# Altium project SnippetsMCU.PrjPCB
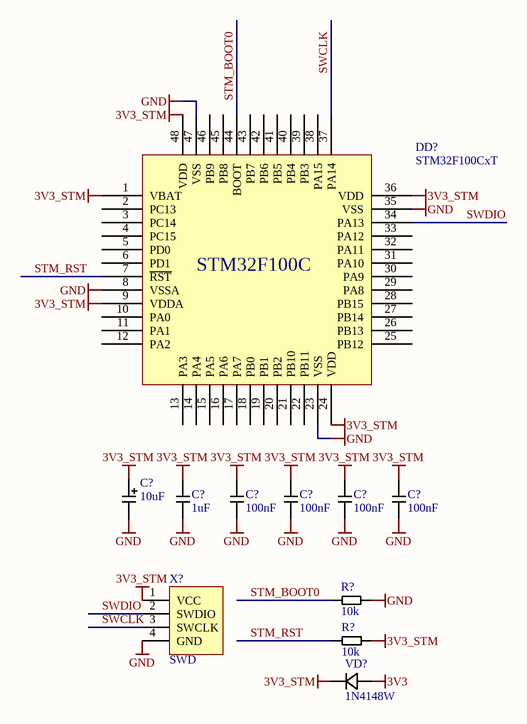
[diagram p0: STM32F100CxT_simple.SchDoc]
9 sheets, 140 parts. Net scope: global (net labels, ports and power ports of the same name join across sheets).
Sheets:
  STM32F100CxT_simple.SchDoc
  STM32F100CxT_with_analog.SchDoc
  STM32F100RxT_simple.SchDoc
  STM32F103CxT_simple.SchDoc
  STM32F103RxT_simple.SchDoc
  STM32F407VxT_simple.SchDoc
  STM32F417VxT_simple.SchDoc
  TM4C1294NCPDT_simple.SchDoc
  STM32F302VBT_simple.SchDoc

## Sheet STM32F100CxT_simple.SchDoc
size A4

### Parts
(Parts that share a designator on the sheet are numbered #1, #2 ... from top to bottom, then left to right.)
C?#1  10uF  [SMD A]
C?#2  1uF  [C0603]
C?#3  100nF  [C0603]
C?#4  100nF  [C0603]
C?#5  100nF  [C0603]
C?#6  100nF  [C0603]
DD?#1  STM32F100CxT  [LQFP-48]
R?#1  10k  [R0603]
R?#2  10k  [R0603]
VD?#1  1N4148W  [SOD-123]
X?#1  SWD  [SWD-4]

### Nets
3V3: VD?#1.1(K)
3V3_STM: C?#1.1 C?#2.1 C?#3.1 C?#4.1 C?#5.1 C?#6.1 DD?#1.1(VBAT) DD?#1.9(VDDA) DD?#1.24(VDD) DD?#1.36(VDD) DD?#1.48(VDD) R?#2.2 VD?#1.2(A) X?#1.1(VCC)
GND: C?#1.2 C?#2.2 C?#3.2 C?#4.2 C?#5.2 C?#6.2 DD?#1.8(VSSA) DD?#1.23(VSS) DD?#1.35(VSS) DD?#1.47(VSS) R?#1.1 X?#1.4(GND)
STM_BOOT0: DD?#1.44(BOOT) R?#1.2
STM_RST: DD?#1.7(~{RST}) R?#2.1
SWCLK: DD?#1.37(PA14) X?#1.3(SWCLK)
SWDIO: DD?#1.34(PA13) X?#1.2(SWDIO)

Not connected (* = marked no-connect by the designer): DD?#1 2(PC13) 3(PC14) 4(PC15) 5(PD0) 6(PD1) 10(PA0) 11(PA1) 12(PA2) 13(PA3) 14(PA4) 15(PA5) 16(PA6) 17(PA7) 18(PB0) 19(PB1) 20(PB2) 21(PB10) 22(PB11) 25(PB12) 26(PB13) 27(PB14) 28(PB15) 29(PA8) 30(PA9) 31(PA10) 32(PA11) 33(PA12) 38(PA15) 39(PB3) 40(PB4) 41(PB5) 42(PB6) 43(PB7) 45(PB8) 46(PB9)

### Notes on the sheet
- (in symbol STM32F100CxT) STM32F100C

### Library data of the parts
C?#1 = CP: Capacitor polarized
C?#2-C?#6 = C: Capacitor
DD?#1 = STM32F100CxT: STM Microcontroller
R?#1 R?#2 = R: Resistor
VD?#1 = Diode: SMD diode
X?#1 = SWD_4: SWD connector

## Sheet STM32F100CxT_with_analog.SchDoc
size A4
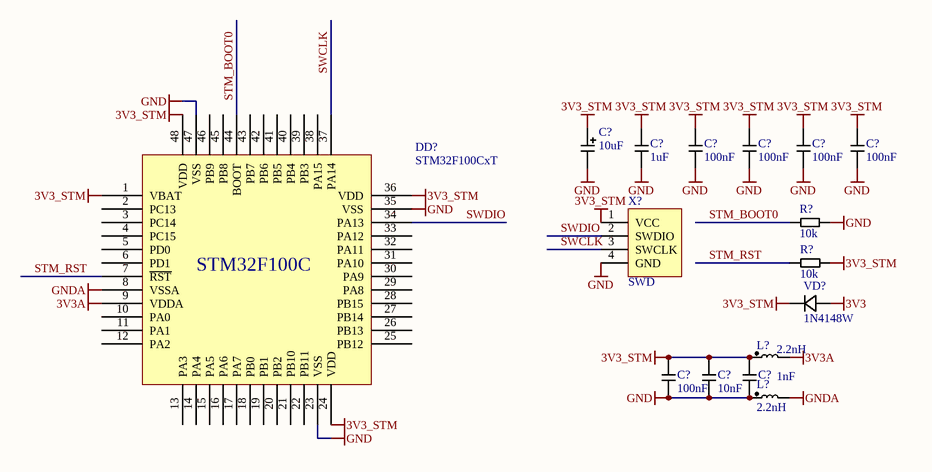
[diagram p1: STM32F100CxT_with_analog.SchDoc]

### Parts
(Parts that share a designator on the sheet are numbered #1, #2 ... from top to bottom, then left to right.)
C?#7  10uF  [SMD A]
C?#8  1uF  [C0603]
C?#9  100nF  [C0603]
C?#10  100nF  [C0603]
C?#11  100nF  [C0603]
C?#12  100nF  [C0603]
C?#13  100nF  [C0603]
C?#14  10nF  [C0603]
C?#15  1nF  [C0603]
DD?#2  STM32F100CxT  [LQFP-48]
L?#1  2.2nH  [L0603]
L?#2  2.2nH  [L0603]
R?#3  10k  [R0603]
R?#4  10k  [R0603]
VD?#2  1N4148W  [SOD-123]
X?#2  SWD  [SWD-4]

### Nets
3V3: VD?#2.1(K)
3V3_STM: C?#7.1 C?#8.1 C?#9.1 C?#10.1 C?#11.1 C?#12.1 C?#13.1 C?#14.1 C?#15.1 DD?#2.1(VBAT) DD?#2.24(VDD) DD?#2.36(VDD) DD?#2.48(VDD) L?#1.1 R?#4.2 VD?#2.2(A) X?#2.1(VCC)
3V3A: DD?#2.9(VDDA) L?#1.2
GND: C?#7.2 C?#8.2 C?#9.2 C?#10.2 C?#11.2 C?#12.2 C?#13.2 C?#14.2 C?#15.2 DD?#2.23(VSS) DD?#2.35(VSS) DD?#2.47(VSS) L?#2.1 R?#3.1 X?#2.4(GND)
GNDA: DD?#2.8(VSSA) L?#2.2
STM_BOOT0: DD?#2.44(BOOT) R?#3.2
STM_RST: DD?#2.7(~{RST}) R?#4.1
SWCLK: DD?#2.37(PA14) X?#2.3(SWCLK)
SWDIO: DD?#2.34(PA13) X?#2.2(SWDIO)

Not connected (* = marked no-connect by the designer): DD?#2 2(PC13) 3(PC14) 4(PC15) 5(PD0) 6(PD1) 10(PA0) 11(PA1) 12(PA2) 13(PA3) 14(PA4) 15(PA5) 16(PA6) 17(PA7) 18(PB0) 19(PB1) 20(PB2) 21(PB10) 22(PB11) 25(PB12) 26(PB13) 27(PB14) 28(PB15) 29(PA8) 30(PA9) 31(PA10) 32(PA11) 33(PA12) 38(PA15) 39(PB3) 40(PB4) 41(PB5) 42(PB6) 43(PB7) 45(PB8) 46(PB9)

### Notes on the sheet
- (in symbol STM32F100CxT) STM32F100C

### Library data of the parts
C?#7 = CP: Capacitor polarized
C?#8-C?#15 = C: Capacitor
DD?#2 = STM32F100CxT: STM Microcontroller
L?#1 L?#2 = L: Inductor
R?#3 R?#4 = R: Resistor
VD?#2 = Diode: SMD diode
X?#2 = SWD_4: SWD connector

## Sheet STM32F100RxT_simple.SchDoc
size A4
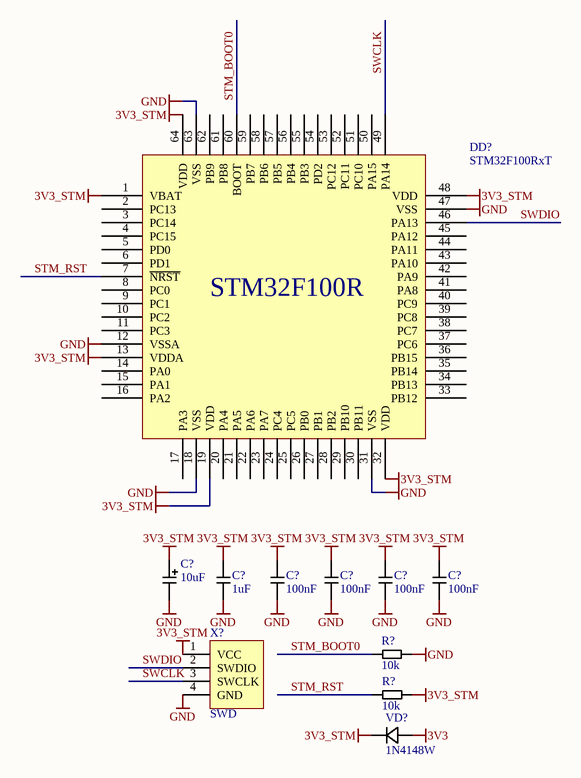
[diagram p2: STM32F100RxT_simple.SchDoc]

### Parts
(Parts that share a designator on the sheet are numbered #1, #2 ... from top to bottom, then left to right.)
C?#16  10uF  [SMD A]
C?#17  1uF  [C0603]
C?#18  100nF  [C0603]
C?#19  100nF  [C0603]
C?#20  100nF  [C0603]
C?#21  100nF  [C0603]
DD?#3  STM32F100RxT  [LQFP-64]
R?#5  10k  [R0603]
R?#6  10k  [R0603]
VD?#3  1N4148W  [SOD-123]
X?#3  SWD  [SWD-4]

### Nets
3V3: VD?#3.1(K)
3V3_STM: C?#16.1 C?#17.1 C?#18.1 C?#19.1 C?#20.1 C?#21.1 DD?#3.1(VBAT) DD?#3.13(VDDA) DD?#3.19(VDD) DD?#3.32(VDD) DD?#3.48(VDD) DD?#3.64(VDD) R?#6.2 VD?#3.2(A) X?#3.1(VCC)
GND: C?#16.2 C?#17.2 C?#18.2 C?#19.2 C?#20.2 C?#21.2 DD?#3.12(VSSA) DD?#3.18(VSS) DD?#3.31(VSS) DD?#3.47(VSS) DD?#3.63(VSS) R?#5.1 X?#3.4(GND)
STM_BOOT0: DD?#3.60(BOOT) R?#5.2
STM_RST: DD?#3.7(~{NRST}) R?#6.1
SWCLK: DD?#3.49(PA14) X?#3.3(SWCLK)
SWDIO: DD?#3.46(PA13) X?#3.2(SWDIO)

Not connected (* = marked no-connect by the designer): DD?#3 2(PC13) 3(PC14) 4(PC15) 5(PD0) 6(PD1) 8(PC0) 9(PC1) 10(PC2) 11(PC3) 14(PA0) 15(PA1) 16(PA2) 17(PA3) 20(PA4) 21(PA5) 22(PA6) 23(PA7) 24(PC4) 25(PC5) 26(PB0) 27(PB1) 28(PB2) 29(PB10) 30(PB11) 33(PB12) 34(PB13) 35(PB14) 36(PB15) 37(PC6) 38(PC7) 39(PC8) 40(PC9) 41(PA8) 42(PA9) 43(PA10) 44(PA11) 45(PA12) 50(PA15) 51(PC10) 52(PC11) 53(PC12) 54(PD2) 55(PB3) 56(PB4) 57(PB5) 58(PB6) 59(PB7) 61(PB8) 62(PB9)

### Notes on the sheet
- (in symbol STM32F100RxT) STM32F100R

### Library data of the parts
C?#16 = CP: Capacitor polarized
C?#17-C?#21 = C: Capacitor
DD?#3 = STM32F100RxT: STM Microcontroller
R?#5 R?#6 = R: Resistor
VD?#3 = Diode: SMD diode
X?#3 = SWD_4: SWD connector

## Sheet STM32F103CxT_simple.SchDoc
size A4
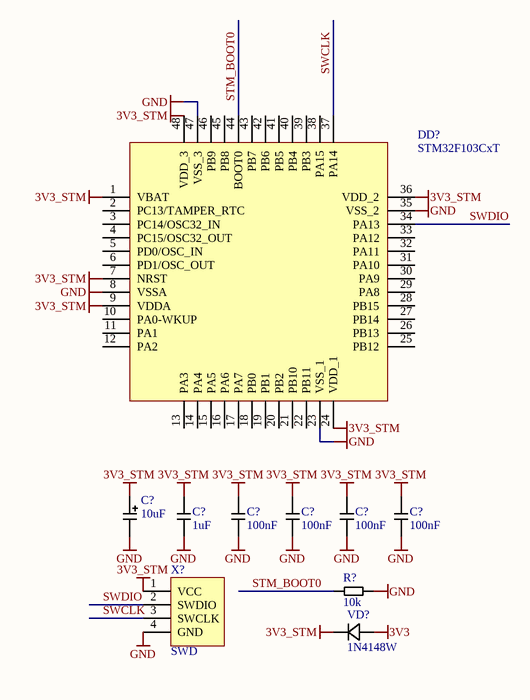
[diagram p3: STM32F103CxT_simple.SchDoc]

### Parts
(Parts that share a designator on the sheet are numbered #1, #2 ... from top to bottom, then left to right.)
C?#22  10uF  [SMD A]
C?#23  1uF  [C0603]
C?#24  100nF  [C0603]
C?#25  100nF  [C0603]
C?#26  100nF  [C0603]
C?#27  100nF  [C0603]
DD?#4  STM32F103CxT  [LQFP-48]
R?#7  10k  [R0603]
VD?#4  1N4148W  [SOD-123]
X?#4  SWD  [SWD-4]

### Nets
3V3: VD?#4.1(K)
3V3_STM: C?#22.1 C?#23.1 C?#24.1 C?#25.1 C?#26.1 C?#27.1 DD?#4.1(VBAT) DD?#4.7(NRST) DD?#4.9(VDDA) DD?#4.24(VDD_1) DD?#4.36(VDD_2) DD?#4.48(VDD_3) VD?#4.2(A) X?#4.1(VCC)
GND: C?#22.2 C?#23.2 C?#24.2 C?#25.2 C?#26.2 C?#27.2 DD?#4.8(VSSA) DD?#4.23(VSS_1) DD?#4.35(VSS_2) DD?#4.47(VSS_3) R?#7.1 X?#4.4(GND)
STM_BOOT0: DD?#4.44(BOOT0) R?#7.2
SWCLK: DD?#4.37(PA14) X?#4.3(SWCLK)
SWDIO: DD?#4.34(PA13) X?#4.2(SWDIO)

Not connected (* = marked no-connect by the designer): DD?#4 2(PC13/TAMPER_RTC) 3(PC14/OSC32_IN) 4(PC15/OSC32_OUT) 5(PD0/OSC_IN) 6(PD1/OSC_OUT) 10(PA0-WKUP) 11(PA1) 12(PA2) 13(PA3) 14(PA4) 15(PA5) 16(PA6) 17(PA7) 18(PB0) 19(PB1) 20(PB2) 21(PB10) 22(PB11) 25(PB12) 26(PB13) 27(PB14) 28(PB15) 29(PA8) 30(PA9) 31(PA10) 32(PA11) 33(PA12) 38(PA15) 39(PB3) 40(PB4) 41(PB5) 42(PB6) 43(PB7) 45(PB8) 46(PB9)

### Library data of the parts
C?#22 = CP: Capacitor polarized
C?#23-C?#27 = C: Capacitor
DD?#4 = STM32F103CxT: ST MCU with USB
R?#7 = R: Resistor
VD?#4 = Diode: SMD diode
X?#4 = SWD_4: SWD connector

## Sheet STM32F103RxT_simple.SchDoc
size A4
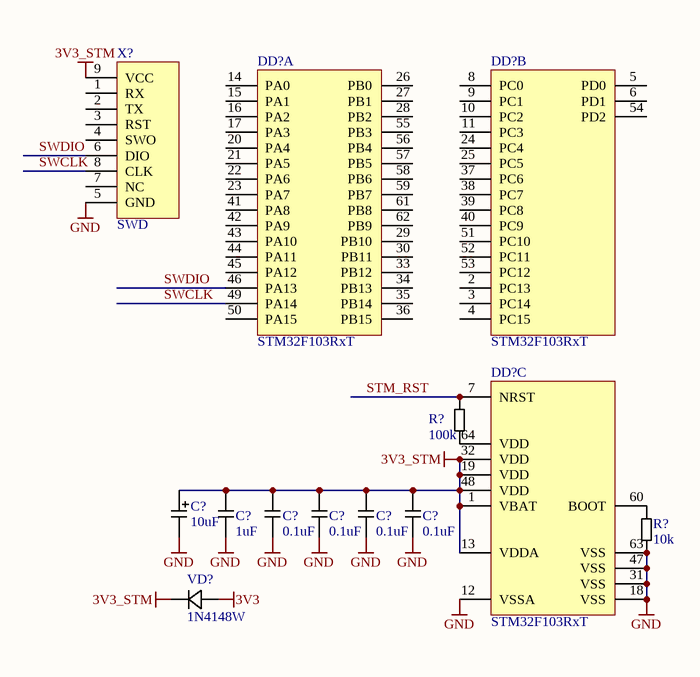
[diagram p4: STM32F103RxT_simple.SchDoc]

### Parts
(Parts that share a designator on the sheet are numbered #1, #2 ... from top to bottom, then left to right.)
C?#28  10uF  [SMD A]
C?#29  1uF  [C0603]
C?#30  0.1uF  [C0603]
C?#31  0.1uF  [C0603]
C?#32  0.1uF  [C0603]
C?#33  0.1uF  [C0603]
DD?#5  STM32F103RxT  [LQFP-64]  (part A of 3)
DD?#6  STM32F103RxT  [LQFP-64]  (part B of 3)
DD?#7  STM32F103RxT  [LQFP-64]  (part C of 3)
R?#8  100k  [R0603]
R?#9  10k  [R0603]
VD?#5  1N4148W  [SOD-123]
X?#5  SWD  [PogoSWD]

### Nets
3V3: VD?#5.1(K)
3V3_STM: C?#28.1 C?#29.1 C?#30.1 C?#31.1 C?#32.1 C?#33.1 DD?#7.1(VBAT) DD?#7.13(VDDA) DD?#7.19(VDD) DD?#7.32(VDD) DD?#7.48(VDD) VD?#5.2(A) X?#5.9(VCC)
GND: C?#28.2 C?#29.2 C?#30.2 C?#31.2 C?#32.2 C?#33.2 DD?#7.12(VSSA) DD?#7.18(VSS) DD?#7.31(VSS) DD?#7.47(VSS) DD?#7.63(VSS) R?#9.2 X?#5.5(GND)
STM_RST: DD?#7.7(NRST) R?#8.2
SWCLK: DD?#5.49(PA14) X?#5.8(CLK)
SWDIO: DD?#5.46(PA13) X?#5.6(DIO)
NetDD?#7_60: DD?#7.60(BOOT) R?#9.1
NetDD?#7_64: DD?#7.64(VDD) R?#8.1

Not connected (* = marked no-connect by the designer): DD?#5 14(PA0) 15(PA1) 16(PA2) 17(PA3) 20(PA4) 21(PA5) 22(PA6) 23(PA7) 26(PB0) 27(PB1) 28(PB2) 29(PB10) 30(PB11) 33(PB12) 34(PB13) 35(PB14) 36(PB15) 41(PA8) 42(PA9) 43(PA10) 44(PA11) 45(PA12) 50(PA15) 55(PB3) 56(PB4) 57(PB5) 58(PB6) 59(PB7) 61(PB8) 62(PB9); DD?#6 2(PC13) 3(PC14) 4(PC15) 5(PD0) 6(PD1) 8(PC0) 9(PC1) 10(PC2) 11(PC3) 24(PC4) 25(PC5) 37(PC6) 38(PC7) 39(PC8) 40(PC9) 51(PC10) 52(PC11) 53(PC12) 54(PD2); X?#5 1(RX) 2(TX) 3(RST) 4(SWO) 7(NC)

### Library data of the parts
C?#28 = CP: Capacitor polarized
C?#29-C?#33 = C: Capacitor
DD?#5-DD?#7 = STM32F103RxT: ST MCU with USB
R?#8 R?#9 = R: Resistor
VD?#5 = Diode: SMD diode
X?#5 = SWD-Pogo: SWD connector for PogoPins

## Sheet STM32F407VxT_simple.SchDoc
size A4
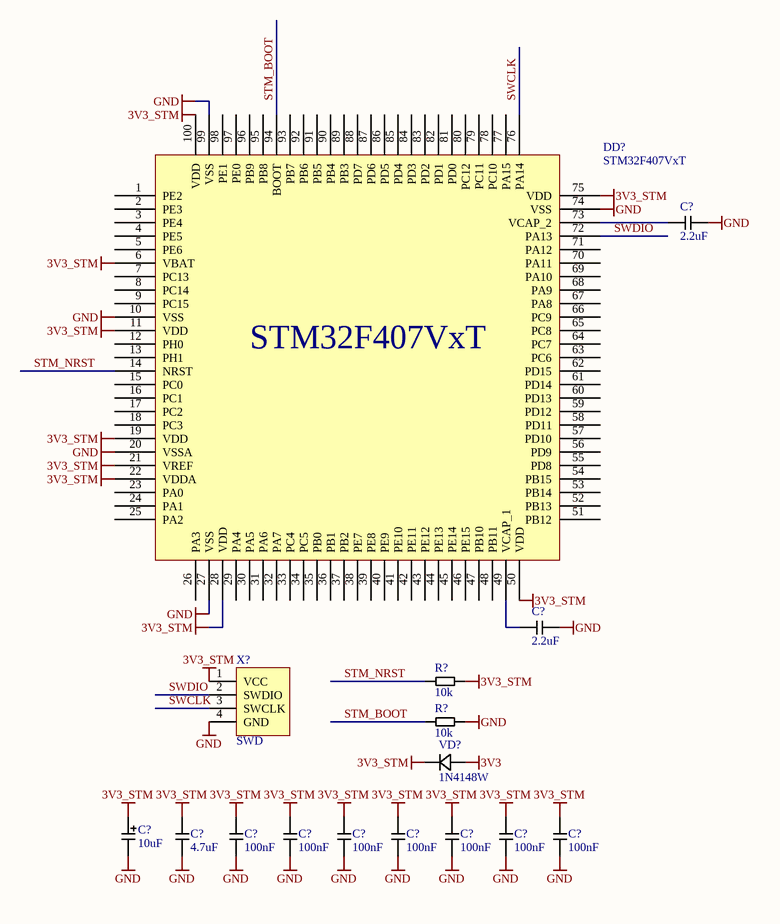
[diagram p5: STM32F407VxT_simple.SchDoc]

### Parts
(Parts that share a designator on the sheet are numbered #1, #2 ... from top to bottom, then left to right.)
C?#34  2.2uF  [C0603]
C?#35  2.2uF  [C0603]
C?#36  10uF  [SMD A]
C?#37  4.7uF  [C0603]
C?#38  100nF  [C0603]
C?#39  100nF  [C0603]
C?#40  100nF  [C0603]
C?#41  100nF  [C0603]
C?#42  100nF  [C0603]
C?#43  100nF  [C0603]
C?#44  100nF  [C0603]
DD?#8  STM32F407VxT  [LQFP-100]
R?#10  10k  [R0603]
R?#11  10k  [R0603]
VD?#6  1N4148W  [SOD-123]
X?#6  SWD  [SWD-4]

### Nets
3V3: VD?#6.1(K)
3V3_STM: C?#36.1 C?#37.1 C?#38.1 C?#39.1 C?#40.1 C?#41.1 C?#42.1 C?#43.1 C?#44.1 DD?#8.6(VBAT) DD?#8.11(VDD) DD?#8.19(VDD) DD?#8.21(VREF) DD?#8.22(VDDA) DD?#8.28(VDD) DD?#8.50(VDD) DD?#8.75(VDD) DD?#8.100(VDD) R?#10.2 VD?#6.2(A) X?#6.1(VCC)
GND: C?#34.1 C?#35.1 C?#36.2 C?#37.2 C?#38.2 C?#39.2 C?#40.2 C?#41.2 C?#42.2 C?#43.2 C?#44.2 DD?#8.10(VSS) DD?#8.20(VSSA) DD?#8.27(VSS) DD?#8.74(VSS) DD?#8.99(VSS) R?#11.2 X?#6.4(GND)
STM_BOOT: DD?#8.94(BOOT) R?#11.1
STM_NRST: DD?#8.14(NRST) R?#10.1
SWCLK: DD?#8.76(PA14) X?#6.3(SWCLK)
SWDIO: DD?#8.72(PA13) X?#6.2(SWDIO)
NetC?#34_2: C?#34.2 DD?#8.73(VCAP_2)
NetC?#35_2: C?#35.2 DD?#8.49(VCAP_1)

Not connected (* = marked no-connect by the designer): DD?#8 1(PE2) 2(PE3) 3(PE4) 4(PE5) 5(PE6) 7(PC13) 8(PC14) 9(PC15) 12(PH0) 13(PH1) 15(PC0) 16(PC1) 17(PC2) 18(PC3) 23(PA0) 24(PA1) 25(PA2) 26(PA3) 29(PA4) 30(PA5) 31(PA6) 32(PA7) 33(PC4) 34(PC5) 35(PB0) 36(PB1) 37(PB2) 38(PE7) 39(PE8) 40(PE9) 41(PE10) 42(PE11) 43(PE12) 44(PE13) 45(PE14) 46(PE15) 47(PB10) 48(PB11) 51(PB12) 52(PB13) 53(PB14) 54(PB15) 55(PD8) 56(PD9) 57(PD10) 58(PD11) 59(PD12) 60(PD13) 61(PD14) 62(PD15) 63(PC6) 64(PC7) 65(PC8) 66(PC9) 67(PA8) 68(PA9) 69(PA10) 70(PA11) 71(PA12) 77(PA15) 78(PC10) 79(PC11) 80(PC12) 81(PD0) 82(PD1) 83(PD2) 84(PD3) 85(PD4) 86(PD5) 87(PD6) 88(PD7) 89(PB3) 90(PB4) 91(PB5) 92(PB6) 93(PB7) 95(PB8) 96(PB9) 97(PE0) 98(PE1)

### Library data of the parts
C?#34 C?#35 C?#37-C?#44 = C: Capacitor
C?#36 = CP: Capacitor polarized
DD?#8 = STM32F407VxT: ST Cortex-M4F MCU LQFP-100
R?#10 R?#11 = R: Resistor
VD?#6 = Diode: SMD diode
X?#6 = SWD_4: SWD connector

## Sheet STM32F417VxT_simple.SchDoc
size A4
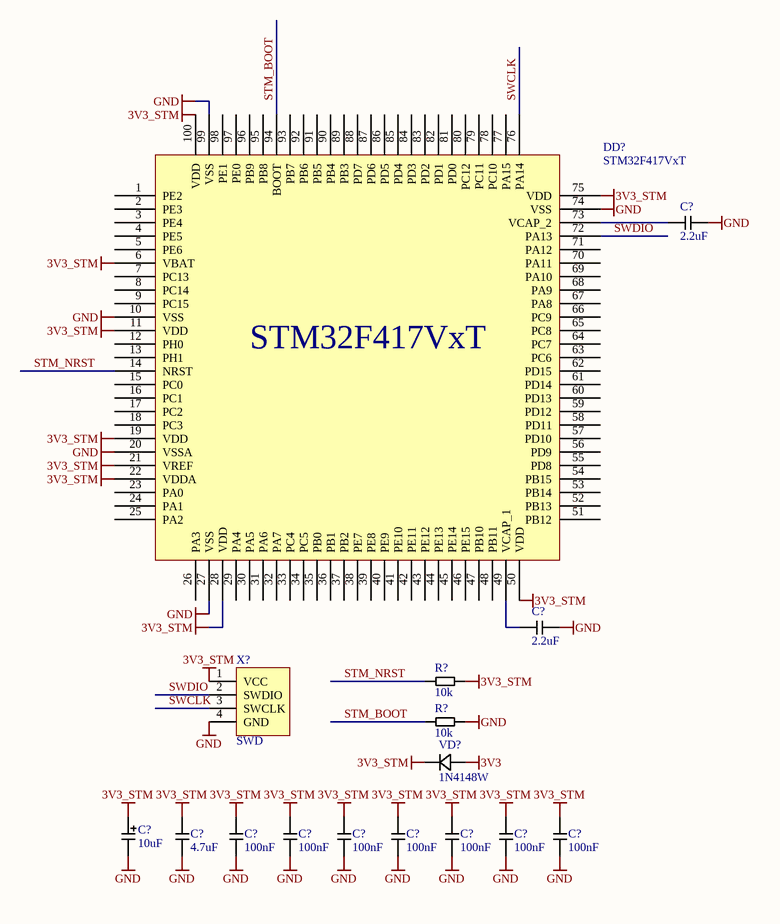
[diagram p6: STM32F417VxT_simple.SchDoc]

### Parts
(Parts that share a designator on the sheet are numbered #1, #2 ... from top to bottom, then left to right.)
C?#45  2.2uF  [C0603]
C?#46  2.2uF  [C0603]
C?#47  10uF  [SMD A]
C?#48  4.7uF  [C0603]
C?#49  100nF  [C0603]
C?#50  100nF  [C0603]
C?#51  100nF  [C0603]
C?#52  100nF  [C0603]
C?#53  100nF  [C0603]
C?#54  100nF  [C0603]
C?#55  100nF  [C0603]
DD?#9  STM32F417VxT  [LQFP-100]
R?#12  10k  [R0603]
R?#13  10k  [R0603]
VD?#7  1N4148W  [SOD-123]
X?#7  SWD  [SWD-4]

### Nets
3V3: VD?#7.1(K)
3V3_STM: C?#47.1 C?#48.1 C?#49.1 C?#50.1 C?#51.1 C?#52.1 C?#53.1 C?#54.1 C?#55.1 DD?#9.6(VBAT) DD?#9.11(VDD) DD?#9.19(VDD) DD?#9.21(VREF) DD?#9.22(VDDA) DD?#9.28(VDD) DD?#9.50(VDD) DD?#9.75(VDD) DD?#9.100(VDD) R?#12.2 VD?#7.2(A) X?#7.1(VCC)
GND: C?#45.1 C?#46.1 C?#47.2 C?#48.2 C?#49.2 C?#50.2 C?#51.2 C?#52.2 C?#53.2 C?#54.2 C?#55.2 DD?#9.10(VSS) DD?#9.20(VSSA) DD?#9.27(VSS) DD?#9.74(VSS) DD?#9.99(VSS) R?#13.2 X?#7.4(GND)
STM_BOOT: DD?#9.94(BOOT) R?#13.1
STM_NRST: DD?#9.14(NRST) R?#12.1
SWCLK: DD?#9.76(PA14) X?#7.3(SWCLK)
SWDIO: DD?#9.72(PA13) X?#7.2(SWDIO)
NetC?#45_2: C?#45.2 DD?#9.73(VCAP_2)
NetC?#46_2: C?#46.2 DD?#9.49(VCAP_1)

Not connected (* = marked no-connect by the designer): DD?#9 1(PE2) 2(PE3) 3(PE4) 4(PE5) 5(PE6) 7(PC13) 8(PC14) 9(PC15) 12(PH0) 13(PH1) 15(PC0) 16(PC1) 17(PC2) 18(PC3) 23(PA0) 24(PA1) 25(PA2) 26(PA3) 29(PA4) 30(PA5) 31(PA6) 32(PA7) 33(PC4) 34(PC5) 35(PB0) 36(PB1) 37(PB2) 38(PE7) 39(PE8) 40(PE9) 41(PE10) 42(PE11) 43(PE12) 44(PE13) 45(PE14) 46(PE15) 47(PB10) 48(PB11) 51(PB12) 52(PB13) 53(PB14) 54(PB15) 55(PD8) 56(PD9) 57(PD10) 58(PD11) 59(PD12) 60(PD13) 61(PD14) 62(PD15) 63(PC6) 64(PC7) 65(PC8) 66(PC9) 67(PA8) 68(PA9) 69(PA10) 70(PA11) 71(PA12) 77(PA15) 78(PC10) 79(PC11) 80(PC12) 81(PD0) 82(PD1) 83(PD2) 84(PD3) 85(PD4) 86(PD5) 87(PD6) 88(PD7) 89(PB3) 90(PB4) 91(PB5) 92(PB6) 93(PB7) 95(PB8) 96(PB9) 97(PE0) 98(PE1)

### Library data of the parts
C?#45 C?#46 C?#48-C?#55 = C: Capacitor
C?#47 = CP: Capacitor polarized
DD?#9 = STM32F417VxT: ST Cortex-M4F MCU LQFP-100
R?#12 R?#13 = R: Resistor
VD?#7 = Diode: SMD diode
X?#7 = SWD_4: SWD connector

## Sheet TM4C1294NCPDT_simple.SchDoc
size A4
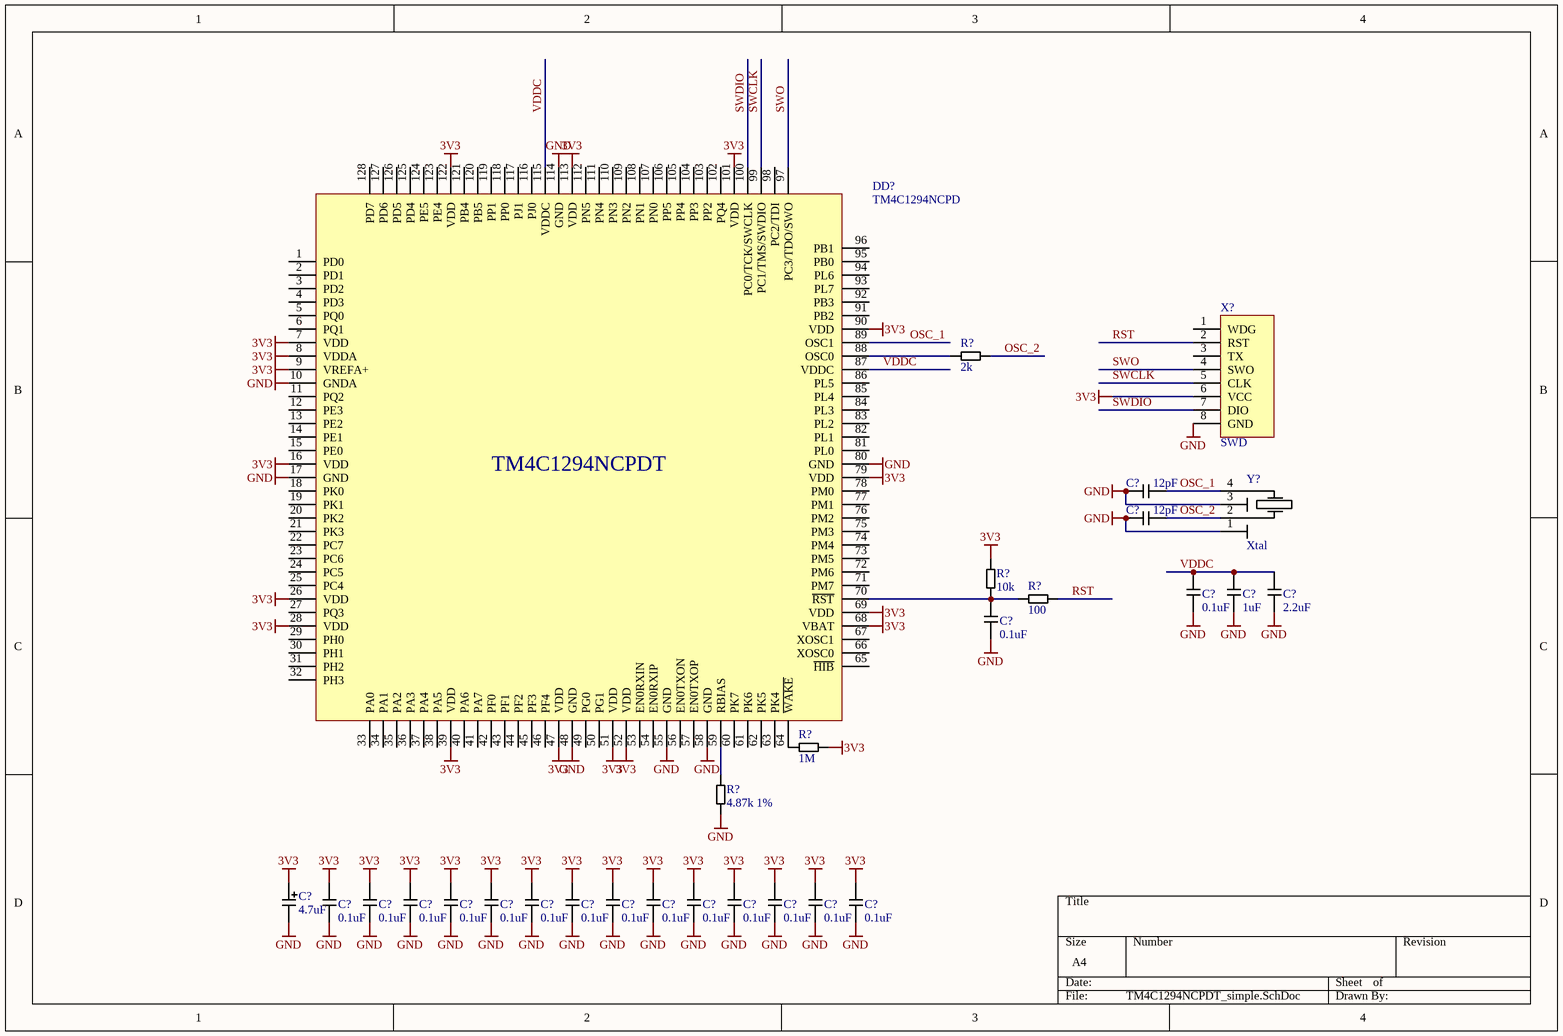
[diagram p7: TM4C1294NCPDT_simple.SchDoc]

### Parts
(Parts that share a designator on the sheet are numbered #1, #2 ... from top to bottom, then left to right.)
C?#56  12pF  [C0603]
C?#57  12pF  [C0603]
C?#58  0.1uF  [C0603]
C?#59  1uF  [C0603]
C?#60  2.2uF  [C0603]
C?#61  0.1uF  [C0603]
C?#62  4.7uF  [SMD A]
C?#63  0.1uF  [C0603]
C?#64  0.1uF  [C0603]
C?#65  0.1uF  [C0603]
C?#66  0.1uF  [C0603]
C?#67  0.1uF  [C0603]
C?#68  0.1uF  [C0603]
C?#69  0.1uF  [C0603]
C?#70  0.1uF  [C0603]
C?#71  0.1uF  [C0603]
C?#72  0.1uF  [C0603]
C?#73  0.1uF  [C0603]
C?#74  0.1uF  [C0603]
C?#75  0.1uF  [C0603]
C?#76  0.1uF  [C0603]
DD?#10  TM4C1294NCPD  [TQFP-128]
R?#14  2k  [R0603]
R?#15  10k  [R0603]
R?#16  100  [R0603]
R?#17  1M  [R0603]
R?#18  4.87k 1%  [R0603]
X?#8  SWD  [PogoSWD]
Y?#1  Xtal  [Xtal 0532]

### Nets
3V3: C?#62.1 C?#63.1 C?#64.1 C?#65.1 C?#66.1 C?#67.1 C?#68.1 C?#69.1 C?#70.1 C?#71.1 C?#72.1 C?#73.1 C?#74.1 C?#75.1 C?#76.1 DD?#10.7(VDD) DD?#10.8(VDDA) DD?#10.9(VREFA+) DD?#10.16(VDD) DD?#10.26(VDD) DD?#10.28(VDD) DD?#10.39(VDD) DD?#10.47(VDD) DD?#10.51(VDD) DD?#10.52(VDD) DD?#10.68(VBAT) DD?#10.69(VDD) DD?#10.79(VDD) DD?#10.90(VDD) DD?#10.101(VDD) DD?#10.113(VDD) DD?#10.122(VDD) R?#15.2 R?#17.2 X?#8.6(VCC)
GND: C?#56.1 C?#57.1 C?#58.2 C?#59.2 C?#60.2 C?#61.2 C?#62.2 C?#63.2 C?#64.2 C?#65.2 C?#66.2 C?#67.2 C?#68.2 C?#69.2 C?#70.2 C?#71.2 C?#72.2 C?#73.2 C?#74.2 C?#75.2 C?#76.2 DD?#10.10(GNDA) DD?#10.17(GND) DD?#10.48(GND) DD?#10.55(GND) DD?#10.58(GND) DD?#10.80(GND) DD?#10.114(GND) R?#18.1 X?#8.8(GND) Y?#1.1(X1) Y?#1.3(X2)
OSC_1: C?#56.2 DD?#10.89(OSC1) Y?#1.4(GND)
OSC_2: C?#57.2 R?#14.2 Y?#1.2(GND)
RST: R?#16.2 X?#8.2(RST)
SWCLK: DD?#10.99(PC1/TMS/SWDIO) X?#8.5(CLK)
SWDIO: DD?#10.100(PC0/TCK/SWCLK) X?#8.7(DIO)
SWO: DD?#10.97(PC3/TDO/SWO) X?#8.4(SWO)
VDDC: C?#58.1 C?#59.1 C?#60.1 DD?#10.87(VDDC) DD?#10.115(VDDC)
NetC?#61_1: C?#61.1 DD?#10.70(~{RST}) R?#15.1 R?#16.1
NetDD?#10_59: DD?#10.59(RBIAS) R?#18.2
NetDD?#10_64: DD?#10.64(~{WAKE}) R?#17.1
NetDD?#10_88: DD?#10.88(OSC0) R?#14.1

Not connected (* = marked no-connect by the designer): DD?#10 1(PD0) 2(PD1) 3(PD2) 4(PD3) 5(PQ0) 6(PQ1) 11(PQ2) 12(PE3) 13(PE2) 14(PE1) 15(PE0) 18(PK0) 19(PK1) 20(PK2) 21(PK3) 22(PC7) 23(PC6) 24(PC5) 25(PC4) 27(PQ3) 29(PH0) 30(PH1) 31(PH2) 32(PH3) 33(PA0) 34(PA1) 35(PA2) 36(PA3) 37(PA4) 38(PA5) 40(PA6) 41(PA7) 42(PF0) 43(PF1) 44(PF2) 45(PF3) 46(PF4) 49(PG0) 50(PG1) 53(EN0RXIN) 54(EN0RXIP) 56(EN0TXON) 57(EN0TXOP) 60(PK7) 61(PK6) 62(PK5) 63(PK4) 65(~{HIB}) 66(XOSC0) 67(XOSC1) 71(PM7) 72(PM6) 73(PM5) 74(PM4) 75(PM3) 76(PM2) 77(PM1) 78(PM0) 81(PL0) 82(PL1) 83(PL2) 84(PL3) 85(PL4) 86(PL5) 91(PB2) 92(PB3) 93(PL7) 94(PL6) 95(PB0) 96(PB1) 98(PC2/TDI) 102(PQ4) 103(PP2) 104(PP3) 105(PP4) 106(PP5) 107(PN0) 108(PN1) 109(PN2) 110(PN3) 111(PN4) 112(PN5) 116(PJ0) 117(PJ1) 118(PP0) 119(PP1) 120(PB5) 121(PB4) 123(PE4) 124(PE5) 125(PD4) 126(PD5) 127(PD6) 128(PD7); X?#8 1(WDG) 3(TX)

### Notes on the sheet
- (in symbol TM4C1294NCPD) TM4C1294NCPDT

### Library data of the parts
C?#56-C?#61 C?#63-C?#76 = C: Capacitor
C?#62 = CP: Capacitor polarized
DD?#10 = TM4C1294NCPD: TI Cortex-M4F MCU Tiva-C
R?#14-R?#18 = R: Resistor
X?#8 = SWD-Pogo: SWD connector for PogoPins
Y?#1 = Xtal: Quartz crystal

## Sheet STM32F302VBT_simple.SchDoc
size A4
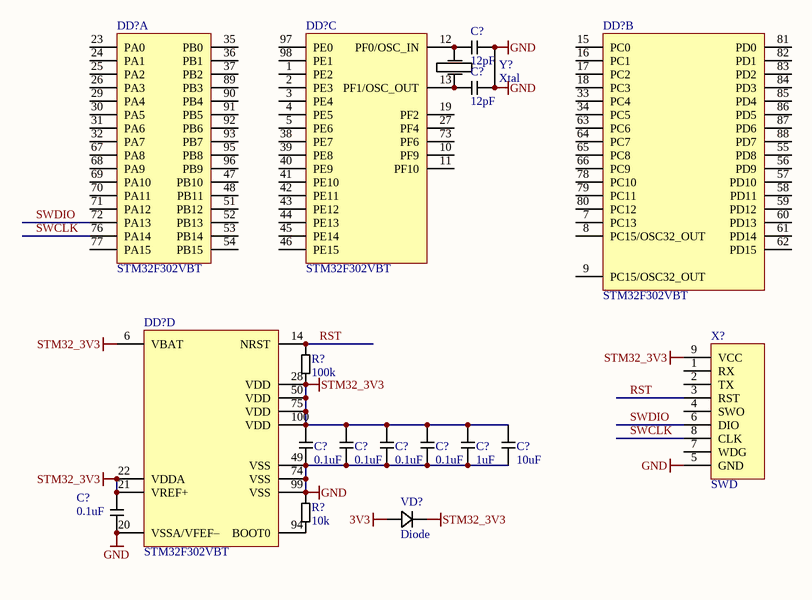
[diagram p8: STM32F302VBT_simple.SchDoc]

### Parts
(Parts that share a designator on the sheet are numbered #1, #2 ... from top to bottom, then left to right.)
C?#77  12pF  [C0603]
C?#78  12pF  [C0603]
C?#79  0.1uF  [C0603]
C?#80  0.1uF  [C0603]
C?#81  0.1uF  [C0603]
C?#82  0.1uF  [C0603]
C?#83  1uF  [C0603]
C?#84  10uF  [C0603]
C?#85  0.1uF  [C0603]
DD?#11  STM32F302VBT  [LQFP-100]  (part A of 4)
DD?#12  STM32F302VBT  [LQFP-100]  (part C of 4)
DD?#13  STM32F302VBT  [LQFP-100]  (part B of 4)
DD?#14  STM32F302VBT  [LQFP-100]  (part D of 4)
R?#19  100k  [R0603]
R?#20  10k  [R0603]
VD?#8  Diode  [SOD-323]
X?#9  SWD  [PogoSWD]
Y?#2  Xtal  [Xtal 0532]

### Nets
3V3: VD?#8.1(K)
GND: C?#77.2 C?#78.2 C?#79.2 C?#80.2 C?#81.2 C?#82.2 C?#83.2 C?#84.2 C?#85.2 DD?#14.20(VSSA/VFEF–) DD?#14.49(VSS) DD?#14.74(VSS) DD?#14.99(VSS) R?#20.2 X?#9.5(GND) Y?#2.1(GND) Y?#2.3(GND)
STM32_3V3: C?#79.1 C?#80.1 C?#81.1 C?#82.1 C?#83.1 C?#84.1 C?#85.1 DD?#14.6(VBAT) DD?#14.21(VREF+) DD?#14.22(VDDA) DD?#14.28(VDD) DD?#14.50(VDD) DD?#14.75(VDD) DD?#14.100(VDD) R?#19.1 VD?#8.2(A) X?#9.9(VCC)
RST: DD?#14.14(NRST) R?#19.2 X?#9.3(RST)
SWCLK: DD?#11.76(PA14) X?#9.8(CLK)
SWDIO: DD?#11.72(PA13) X?#9.6(DIO)
NetC?#77_1: C?#77.1 DD?#12.12(PF0/OSC_IN) Y?#2.4(X2)
NetC?#78_1: C?#78.1 DD?#12.13(PF1/OSC_OUT) Y?#2.2(X1)
NetDD?#14_94: DD?#14.94(BOOT0) R?#20.1

Not connected (* = marked no-connect by the designer): DD?#11 23(PA0) 24(PA1) 25(PA2) 26(PA3) 29(PA4) 30(PA5) 31(PA6) 32(PA7) 35(PB0) 36(PB1) 37(PB2) 47(PB10) 48(PB11) 51(PB12) 52(PB13) 53(PB14) 54(PB15) 67(PA8) 68(PA9) 69(PA10) 70(PA11) 71(PA12) 77(PA15) 89(PB3) 90(PB4) 91(PB5) 92(PB6) 93(PB7) 95(PB8) 96(PB9); DD?#12 1(PE2) 2(PE3) 3(PE4) 4(PE5) 5(PE6) 10(PF9) 11(PF10) 19(PF2) 27(PF4) 38(PE7) 39(PE8) 40(PE9) 41(PE10) 42(PE11) 43(PE12) 44(PE13) 45(PE14) 46(PE15) 73(PF6) 97(PE0) 98(PE1); DD?#13 7(PC13) 8(PC15/OSC32_OUT) 9(PC15/OSC32_OUT) 15(PC0) 16(PC1) 17(PC2) 18(PC3) 33(PC4) 34(PC5) 55(PD8) 56(PD9) 57(PD10) 58(PD11) 59(PD12) 60(PD13) 61(PD14) 62(PD15) 63(PC6) 64(PC7) 65(PC8) 66(PC9) 78(PC10) 79(PC11) 80(PC12) 81(PD0) 82(PD1) 83(PD2) 84(PD3) 85(PD4) 86(PD5) 87(PD6) 88(PD7); X?#9 1(RX) 2(TX) 4(SWO) 7(WDG)

### Library data of the parts
C?#77-C?#85 = C: Capacitor
DD?#11-DD?#14 = STM32F302VBT: ST Cortex-M4F MCU LQFP-100
R?#19 R?#20 = R: Resistor
VD?#8 = Diode: SMD diode
X?#9 = SWD-Pogo: SWD connector for PogoPins
Y?#2 = Xtal: Quartz crystal

## Nets that join several sheets
3V3: STM32F100CxT_simple (VD?#1.1), STM32F100CxT_with_analog (VD?#2.1), STM32F100RxT_simple (VD?#3.1), STM32F103CxT_simple (VD?#4.1), STM32F103RxT_simple (VD?#5.1), STM32F407VxT_simple (VD?#6.1), STM32F417VxT_simple (VD?#7.1), TM4C1294NCPDT_simple (35 pins), STM32F302VBT_simple (VD?#8.1)
3V3_STM: STM32F100CxT_simple (14 pins), STM32F100CxT_with_analog (17 pins), STM32F100RxT_simple (15 pins), STM32F103CxT_simple (14 pins), STM32F103RxT_simple (13 pins), STM32F407VxT_simple (21 pins), STM32F417VxT_simple (21 pins)
GND: STM32F100CxT_simple (12 pins), STM32F100CxT_with_analog (15 pins), STM32F100RxT_simple (13 pins), STM32F103CxT_simple (12 pins), STM32F103RxT_simple (13 pins), STM32F407VxT_simple (18 pins), STM32F417VxT_simple (18 pins), TM4C1294NCPDT_simple (32 pins), STM32F302VBT_simple (17 pins)
RST: TM4C1294NCPDT_simple (R?#16.2 X?#8.2), STM32F302VBT_simple (DD?#14.14 R?#19.2 X?#9.3)
STM_BOOT: STM32F407VxT_simple (DD?#8.94 R?#11.1), STM32F417VxT_simple (DD?#9.94 R?#13.1)
STM_BOOT0: STM32F100CxT_simple (DD?#1.44 R?#1.2), STM32F100CxT_with_analog (DD?#2.44 R?#3.2), STM32F100RxT_simple (DD?#3.60 R?#5.2), STM32F103CxT_simple (DD?#4.44 R?#7.2)
STM_NRST: STM32F407VxT_simple (DD?#8.14 R?#10.1), STM32F417VxT_simple (DD?#9.14 R?#12.1)
STM_RST: STM32F100CxT_simple (DD?#1.7 R?#2.1), STM32F100CxT_with_analog (DD?#2.7 R?#4.1), STM32F100RxT_simple (DD?#3.7 R?#6.1), STM32F103RxT_simple (DD?#7.7 R?#8.2)
SWCLK: STM32F100CxT_simple (DD?#1.37 X?#1.3), STM32F100CxT_with_analog (DD?#2.37 X?#2.3), STM32F100RxT_simple (DD?#3.49 X?#3.3), STM32F103CxT_simple (DD?#4.37 X?#4.3), STM32F103RxT_simple (DD?#5.49 X?#5.8), STM32F407VxT_simple (DD?#8.76 X?#6.3), STM32F417VxT_simple (DD?#9.76 X?#7.3), TM4C1294NCPDT_simple (DD?#10.99 X?#8.5), STM32F302VBT_simple (DD?#11.76 X?#9.8)
SWDIO: STM32F100CxT_simple (DD?#1.34 X?#1.2), STM32F100CxT_with_analog (DD?#2.34 X?#2.2), STM32F100RxT_simple (DD?#3.46 X?#3.2), STM32F103CxT_simple (DD?#4.34 X?#4.2), STM32F103RxT_simple (DD?#5.46 X?#5.6), STM32F407VxT_simple (DD?#8.72 X?#6.2), STM32F417VxT_simple (DD?#9.72 X?#7.2), TM4C1294NCPDT_simple (DD?#10.100 X?#8.7), STM32F302VBT_simple (DD?#11.72 X?#9.6)